# Altium schematic sheet STM32.SchDoc
size A; SheetNumber: 3; SheetTotal: 8
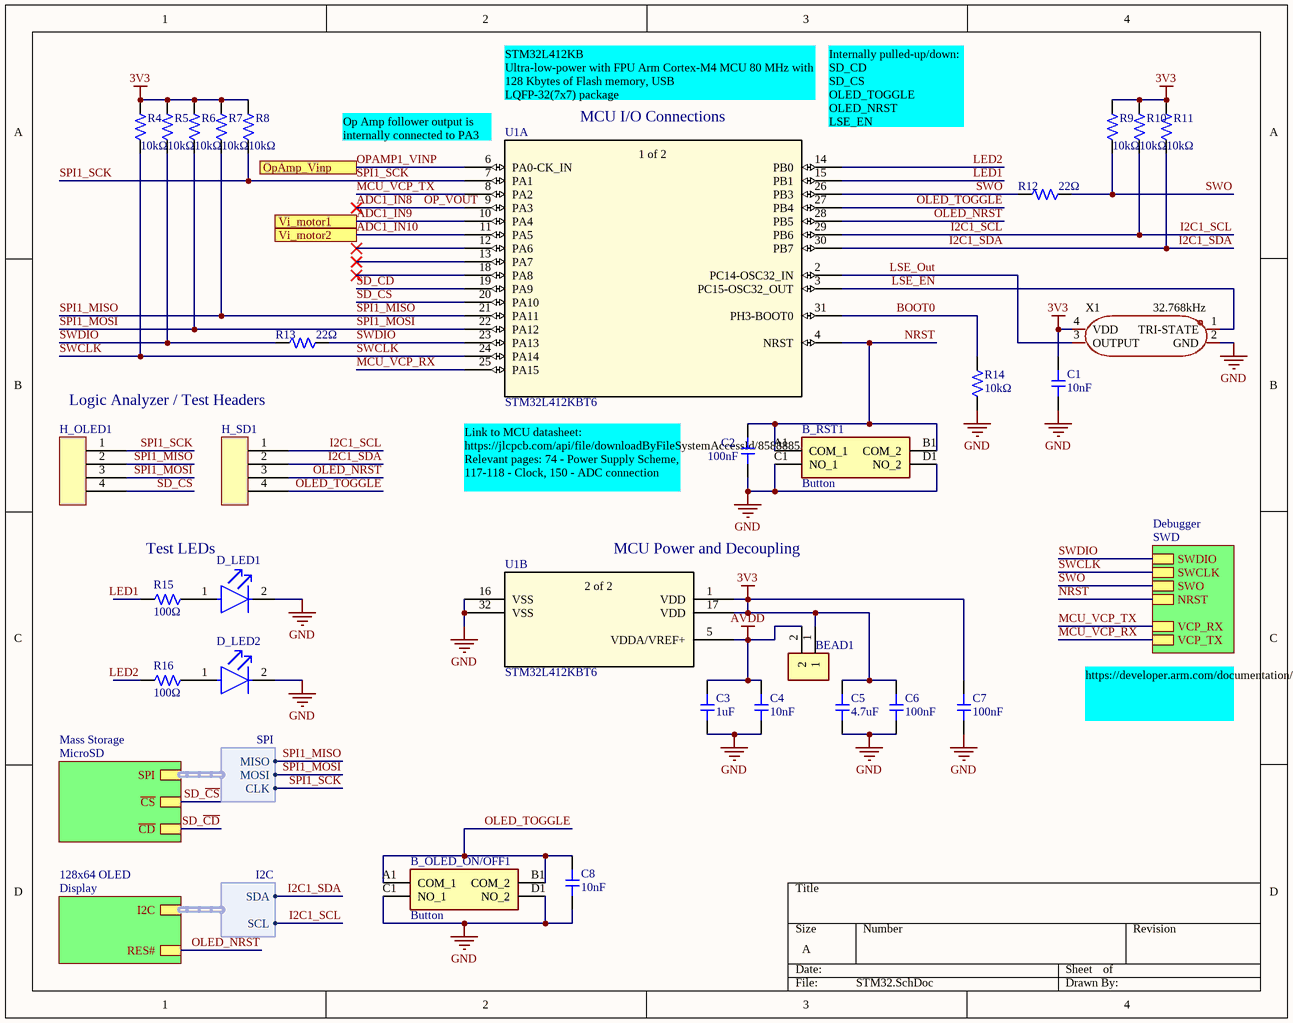
[diagram p0: STM32.SchDoc]

## Parts
B_OLED_ON/OFF1  Button  [TS1187ABAB]
B_RST1  Button  [TS1187ABAB]
BEAD1  GZ1608D601TF  [BEADC1608X95N]  (value not drawn)
C1  Capacitance: 10nF  [CAP-0402]  (hidden comment: CL05B103KB5NNNC)
C2  Capacitance: 100nF  [CAP-0402]  (hidden comment: CL05B104KB54PNC)
C3  Capacitance: 1uF  [CAP-0402]  (hidden comment: CL05A105KA5NQNC)
C4  Capacitance: 10nF  [CAP-0402]  (hidden comment: CL05B103KB5NNNC)
C5  Capacitance: 4.7uF  [CAP-0402]  (hidden comment: CL05A475MP5NRNC)
C6  Capacitance: 100nF  [CAP-0402]  (hidden comment: CL05B104KO5NNNC)
C7  Capacitance: 100nF  [CAP-0402]  (hidden comment: CL05B104KO5NNNC)
C8  Capacitance: 10nF  [CAP-0402]  (hidden comment: CL05B103KB5NNNC)
D_LED1  (no value)  [FP-AP2012EC-MFG]
D_LED2  (no value)  [FP-AP2012EC-MFG]
H_OLED1  4-pin Header  [4-pin Header]  (value not drawn)
H_SD1  4-pin Header  [4-pin Header]  (value not drawn)
R4  Resistance: 10kΩ  [RES-0402]  (hidden comment: 0402WGF1002TCE)
R5  Resistance: 10kΩ  [RES-0402]  (hidden comment: 0402WGF1002TCE)
R6  Resistance: 10kΩ  [RES-0402]  (hidden comment: 0402WGF1002TCE)
R7  Resistance: 10kΩ  [RES-0402]  (hidden comment: 0402WGF1002TCE)
R8  Resistance: 10kΩ  [RES-0402]  (hidden comment: 0402WGF1002TCE)
R9  Resistance: 10kΩ  [RES-0402]  (hidden comment: 0402WGF1002TCE)
R10  Resistance: 10kΩ  [RES-0402]  (hidden comment: 0402WGF1002TCE)
R11  Resistance: 10kΩ  [RES-0402]  (hidden comment: 0402WGF1002TCE)
R12  Resistance: 22Ω  [RES-0402]  (hidden comment: 0402WGF220JTCE)
R13  Resistance: 22Ω  [RES-0402]  (hidden comment: 0402WGF220JTCE)
R14  Resistance: 10kΩ  [RES-0402]  (hidden comment: 0402WGF1002TCE)
R15  Resistance: 100Ω  [RES-0402]  (hidden comment: 0402WGF1000TCE)
R16  Resistance: 100Ω  [RES-0402]  (hidden comment: 0402WGF1000TCE)
U1  STM32L412KBT6  [LQFP-32]  (parts A,B of 2)
X1  32.768kHz  [OSC-SMD_4P-L3.2-W2.5-BL]

## Sub-sheets
128x64 OLED = Display: I2C (harness I2C), RES#
Debugger = SWD: SWDIO, SWCLK, SWO, NRST, VCP_TX, VCP_RX
Mass Storage = MicroSD: SPI (harness SPI), ~{CS}, ~{CD}

## Ports
OpAmp_Vinp (see Power[3B]), Vi_motor1 (see Power[3B]), Vi_motor2 (see Power[3B])

## Harnesses
SPI: MISO, MOSI, CLK
I2C: SDA, SCL

## Nets
3V3: BEAD1.1 C1.2 C5.2 C6.2 C7.2 R4.2 R5.2 R6.2 R7.2 R8.2 R9.2 R10.2 R11.2 U1.1(VDD) U1.17(VDD) X1.4(VDD)
AVDD: BEAD1.2 C3.2 C4.2 U1.5(VDDA/VREF+)
GND: B_OLED_ON/OFF1.C1(NO_1) B_OLED_ON/OFF1.D1(NO_2) B_RST1.C1(NO_1) B_RST1.D1(NO_2) C1.1 C2.1 C3.1 C4.1 C5.1 C6.1 C7.1 C8.1 D_LED1.2(C) D_LED2.2(C) R14.1 U1.16(VSS) U1.32(VSS) X1.2(GND)
ADC1_IN8: U1.9(PA3)  [also labelled OP_VOUT]
ADC1_IN9: U1.10(PA4) ; port Vi_motor1
ADC1_IN10: U1.11(PA5) ; port Vi_motor2
BOOT0: R14.2 U1.31(PH3-BOOT0)
I2C1_SCL: H_SD1.1 R10.1 U1.29(PB6) ; sheet 128x64 OLED/I2C.SCL
I2C1_SDA: H_SD1.2 R11.1 U1.30(PB7) ; sheet 128x64 OLED/I2C.SDA
LED1: R15.1 U1.15(PB1)
LED2: R16.1 U1.14(PB0)
LSE_EN: U1.3(PC15-OSC32_OUT) X1.1(TRI-STATE)
LSE_Out: U1.2(PC14-OSC32_IN) X1.3(OUTPUT)
MCU_VCP_RX: U1.25(PA15) ; sheet Debugger/VCP_TX
MCU_VCP_TX: U1.8(PA2) ; sheet Debugger/VCP_RX
NRST: B_RST1.A1(COM_1) B_RST1.B1(COM_2) C2.2 U1.4(NRST) ; sheet Debugger/NRST
OLED_NRST: H_SD1.3 U1.28(PB5) ; sheet 128x64 OLED/RES#
OLED_TOGGLE: B_OLED_ON/OFF1.A1(COM_1) B_OLED_ON/OFF1.B1(COM_2) C8.2 H_SD1.4 U1.27(PB4)
OPAMP1_VINP: U1.6(PA0-CK_IN) ; port OpAmp_Vinp
SD_~{CD}: U1.19(PA9) ; sheet Mass Storage/~{CD}
SD_~{CS}: H_OLED1.4 U1.20(PA10) ; sheet Mass Storage/~{CS}
SPI1_MISO: H_OLED1.2 R7.1 U1.21(PA11) ; sheet Mass Storage/SPI.MISO
SPI1_MOSI: H_OLED1.3 R6.1 U1.22(PA12) ; sheet Mass Storage/SPI.MOSI
SPI1_SCK: H_OLED1.1 R8.1 U1.7(PA1) ; sheet Mass Storage/SPI.CLK
SWCLK: R4.1 U1.24(PA14) ; sheet Debugger/SWCLK
SWDIO: R5.1 R13.1 R13.2 U1.23(PA13) ; sheet Debugger/SWDIO
SWO: R9.1 R12.1 R12.2 U1.26(PB3) ; sheet Debugger/SWO
NetD_LED1_1: D_LED1.1(A) R15.2
NetD_LED2_1: D_LED2.1(A) R16.2

Not connected (* = marked no-connect by the designer): U1 12(PA6)* 13(PA7)* 18(PA8)*

## Notes on the sheet
- STM32L412KB
  Ultra-low-power with FPU Arm Cortex-M4 MCU 80 MHz with 128 Kbytes of Flash memory, USB
  LQFP-32(7x7) package
- (near U1) Op Amp follower output is internally connected to PA3
- (near U1) MCU I/O Connections
- (near U1) Internally pulled-up/down:
  SD_CD
  SD_CS
  OLED_TOGGLE
  OLED_NRST
  LSE_EN
- Logic Analyzer / Test Headers
- Link to MCU datasheet: https://jlcpcb.com/api/file/downloadByFileSystemAccessId/8588885545674424320
  Relevant pages: 74 - Power Supply Scheme, 117-118 - Clock, 150 - ADC connection
- Test LEDs
- (near U1) MCU Power and Decoupling
- https://developer.arm.com/documentation/dui0499/a/Target-Interface-Connections/SWD-connections
- (in symbol STM32L412KBT6, part A) 1 of 2
- (in symbol STM32L412KBT6, part B) 2 of 2

## Library data of the parts
B_OLED_ON/OFF1 B_RST1 = TS-1187A-B-A-B: Manufacturer_Name: XKB Connectivity; Datasheet Link: http://www.helloxkb.com/public/images/pdf/TS-1187A-X-X-X.pdf; Height: 4.05mm; Manufacturer_Part_Number: TS-1187A-B-A-B
BEAD1 = GZ1608D601TF: Ferrite Bead; Manufacturer_Name: SUNLORD; Datasheet Link: https://datasheet.lcsc.com/szlcsc/Sunlord-GZ1608D601TF_C1002.pdf; Height: 0.95mm; Manufacturer_Part_Number: GZ1608D601TF
C1 C4 C8 = CL05B103KB5NNNC: Capacitor, Ceramic (MLCC), 10nF, ±10%, 50V, X7R, ±10%, SMD 0402; Manufacturer: Samsung Electro-Mechanics; Temperature Rating: -55°C ~ 125°C; Capacitance @ 1V DC Bias: 10.426nF; Capacitance @ 1.2V DC Bias: 10.434nF; Capacitance @ 1.35V DC Bias: 10.444nF; Capacitance @ 1.5V DC Bias: 10.455nF; Capacitance @ 1.8V DC Bias: 10.480nF; Capacitance @ 2.5V DC Bias: 10.514nF; Capacitance @ 3.3V DC Bias: 10.519nF; Capacitance @ 3.7V DC Bias: 10.504nF; Capacitance @ 4.2V DC Bias: 10.473nF; Capacitance @ 5V DC Bias: 10.402nF; Capacitance @ 9V DC Bias: 10.052nF; Capacitance @ 12V DC Bias: 9.639nF; Capacitance @ 15V DC Bias: 9.187nF; Capacitance @ 24V DC Bias: 7.606nF; Capacitance @ 36V DC Bias: 5.499nF; Capacitance @ 48V DC Bias: 3.591nF; Impedance (0V Bias) @ 100Hz: 1.57E+05Ω; Impedance (0V Bias) @ 500Hz: 3.19E+04Ω; Impedance (0V Bias) @ 1kHz: 1.61E+04Ω; Impedance (0V Bias) @ 5kHz: 3.27E+03Ω; Impedance (0V Bias) @ 10kHz: 1.65E+03Ω; Impedance (0V Bias) @ 50kHz: 335Ω; Impedance (0V Bias) @ 100kHz: 169Ω; Impedance (0V Bias) @ 500kHz: 34.3Ω; Impedance (0V Bias) @ 1MHz: 17.3Ω; Impedance (0V Bias) @ 5MHz: 3.52Ω; Impedance (0V Bias) @ 10MHz: 1.77Ω; Impedance (0V Bias) @ 50MHz: 0.285Ω; Impedance (0V Bias) @ 100MHz: 0.0835Ω; Impedance (0V Bias) @ 500MHz: 0.751Ω; Impedance (0V Bias) @ 1GHz: 1.42Ω; Impedance (0V Bias) @ 2GHz: 3.22Ω; Impedance (0V Bias) @ 5GHz: 6.48Ω; Package Size: 0402; JLCPCB Basic Part: Yes; JLCPCB Part Number: C15195; Supplier 1: LCSC; Category: Capacitors - MLCC; Supplier Part Number 1: C15195; Manufacturer Part Number: CL05B103KB5NNNC; Tolerance: ±10%; Voltage Rating: 50V; Temperature Coefficient: X7R; RoHS: Yes; ComponentLink1Description: Datasheet; ComponentLink1URL: https://wmsc.lcsc.com/wmsc/upload/file/pdf/v2/lcsc/2304140030_Samsung-Electro-Mechanics-CL05B103KB5NNNC_C15195.pdf; ComponentLink2Description: JLCPCB Part URL; ComponentLink2URL: https://jlcpcb.com/partdetail/C15195; ComponentLink3Description: LCSC Part URL; ComponentLink3URL: https://lcsc.com/product-detail/Multilayer-Ceramic-Capacitors-MLCC---SMD-SMT_Samsung-Electro-Mechanics-Samsung-Electro-Mechanics-CL05B103KB5NNNC_C15195.html; ComponentLink4Description: Samsung Component Library; ComponentLink4URL: https://weblib.samsungsem.com/mlcc/mlcc-ec.do?partNumber=CL05B103KB5NNN
C2 = CL05B104KB54PNC: Capacitor, Ceramic (MLCC), 100nF, ±10%, 50V, X7R, ±10%, SMD 0402; Manufacturer: Samsung Electro-Mechanics; Temperature Rating: -55°C ~ 125°C; Capacitance @ 1V DC Bias: 105.687nF; Capacitance @ 1.2V DC Bias: 105.639nF; Capacitance @ 1.35V DC Bias: 105.594nF; Capacitance @ 1.5V DC Bias: 105.528nF; Capacitance @ 1.8V DC Bias: 105.317nF; Capacitance @ 2.5V DC Bias: 104.216nF; Capacitance @ 3.3V DC Bias: 102.385nF; Capacitance @ 3.7V DC Bias: 101.236nF; Capacitance @ 4.2V DC Bias: 99.650nF; Capacitance @ 5V DC Bias: 96.918nF; Capacitance @ 9V DC Bias: 81.073nF; Capacitance @ 12V DC Bias: 69.786nF; Capacitance @ 15V DC Bias: 59.475nF; Capacitance @ 24V DC Bias: 38.112nF; Capacitance @ 36V DC Bias: 23.027nF; Capacitance @ 48V DC Bias: 16.035nF; Impedance (0V Bias) @ 100Hz: 1.66E+04Ω; Impedance (0V Bias) @ 500Hz: 3.38E+03Ω; Impedance (0V Bias) @ 1kHz: 1.7E+03Ω; Impedance (0V Bias) @ 5kHz: 346Ω; Impedance (0V Bias) @ 10kHz: 175Ω; Impedance (0V Bias) @ 50kHz: 35.5Ω; Impedance (0V Bias) @ 100kHz: 17.9Ω; Impedance (0V Bias) @ 500kHz: 3.64Ω; Impedance (0V Bias) @ 1MHz: 1.84Ω; Impedance (0V Bias) @ 5MHz: 0.366Ω; Impedance (0V Bias) @ 10MHz: 0.172Ω; Impedance (0V Bias) @ 50MHz: 0.0626Ω; Impedance (0V Bias) @ 100MHz: 0.128Ω; Impedance (0V Bias) @ 500MHz: 0.487Ω; Impedance (0V Bias) @ 1GHz: 0.87Ω; Impedance (0V Bias) @ 2GHz: 2Ω; Impedance (0V Bias) @ 5GHz: 3.96Ω; Package Size: 0402; JLCPCB Basic Part: Yes; JLCPCB Part Number: C307331; Supplier 1: LCSC; Category: Capacitors - MLCC; Supplier Part Number 1: C307331; Manufacturer Part Number: CL05B104KB54PNC; Tolerance: ±10%; Voltage Rating: 50V; Temperature Coefficient: X7R; RoHS: Yes; ComponentLink1Description: Datasheet; ComponentLink1URL: https://wmsc.lcsc.com/wmsc/upload/file/pdf/v2/lcsc/2304140030_Samsung-Electro-Mechanics-CL05B104KB54PNC_C307331.pdf; ComponentLink2Description: JLCPCB Part URL; ComponentLink2URL: https://jlcpcb.com/partdetail/C307331; ComponentLink3Description: LCSC Part URL; ComponentLink3URL: https://lcsc.com/product-detail/Multilayer-Ceramic-Capacitors-MLCC---SMD-SMT_Samsung-Electro-Mechanics-Samsung-Electro-Mechanics-CL05B104KB54PNC_C307331.html; ComponentLink4Description: Samsung Component Library; ComponentLink4URL: https://weblib.samsungsem.com/mlcc/mlcc-ec.do?partNumber=CL05B104KB54PN
C3 = CL05A105KA5NQNC: Capacitor, Ceramic (MLCC), 1uF, ±10%, 25V, X5R, ±10%, SMD 0402; Manufacturer: Samsung Electro-Mechanics; Temperature Rating: -55°C ~ 85°C; Capacitance @ 1V DC Bias: 1.014uF; Capacitance @ 1.2V DC Bias: 0.983uF; Capacitance @ 1.35V DC Bias: 0.958uF; Capacitance @ 1.5V DC Bias: 0.932uF; Capacitance @ 1.8V DC Bias: 0.879uF; Capacitance @ 2.5V DC Bias: 0.755uF; Capacitance @ 3.3V DC Bias: 0.618uF; Capacitance @ 3.7V DC Bias: 0.562uF; Capacitance @ 4.2V DC Bias: 0.501uF; Capacitance @ 5V DC Bias: 0.420uF; Capacitance @ 9V DC Bias: 0.204uF; Capacitance @ 12V DC Bias: 0.147uF; Capacitance @ 15V DC Bias: 0.107uF; Capacitance @ 24V DC Bias: 0.061uF; Impedance (0V Bias) @ 100Hz: 1.95E+03Ω; Impedance (0V Bias) @ 500Hz: 402Ω; Impedance (0V Bias) @ 1kHz: 204Ω; Impedance (0V Bias) @ 5kHz: 42Ω; Impedance (0V Bias) @ 10kHz: 21.3Ω; Impedance (0V Bias) @ 50kHz: 4.4Ω; Impedance (0V Bias) @ 100kHz: 2.23Ω; Impedance (0V Bias) @ 500kHz: 0.462Ω; Impedance (0V Bias) @ 1MHz: 0.234Ω; Impedance (0V Bias) @ 5MHz: 0.0392Ω; Impedance (0V Bias) @ 10MHz: 0.0118Ω; Impedance (0V Bias) @ 50MHz: 0.0671Ω; Impedance (0V Bias) @ 100MHz: 0.118Ω; Impedance (0V Bias) @ 500MHz: 0.452Ω; Impedance (0V Bias) @ 1GHz: 0.812Ω; Impedance (0V Bias) @ 2GHz: 1.8Ω; Impedance (0V Bias) @ 5GHz: 3.57Ω; Impedance (25V Bias) @ 100Hz: 2.62E+04Ω; Impedance (25V Bias) @ 500Hz: 5.28E+03Ω; Impedance (25V Bias) @ 1kHz: 2.65E+03Ω; Impedance (25V Bias) @ 5kHz: 533Ω; Impedance (25V Bias) @ 10kHz: 267Ω; Impedance (25V Bias) @ 50kHz: 53.8Ω; Impedance (25V Bias) @ 100kHz: 27Ω; Impedance (25V Bias) @ 500kHz: 5.42Ω; Impedance (25V Bias) @ 1MHz: 2.7Ω; Impedance (25V Bias) @ 5MHz: 0.621Ω; Impedance (25V Bias) @ 10MHz: 0.298Ω; Impedance (25V Bias) @ 50MHz: 0.0523Ω; Impedance (25V Bias) @ 100MHz: 0.113Ω; Impedance (25V Bias) @ 500MHz: 0.451Ω; Impedance (25V Bias) @ 1GHz: 0.82Ω; Impedance (25V Bias) @ 2GHz: 1.85Ω; Impedance (25V Bias) @ 5GHz: 3.51Ω; Package Size: 0402; JLCPCB Basic Part: Yes; JLCPCB Part Number: C52923; Supplier 1: LCSC; Category: Capacitors - MLCC; Supplier Part Number 1: C52923; Manufacturer Part Number: CL05A105KA5NQNC; Tolerance: ±10%; Voltage Rating: 25V; Temperature Coefficient: X5R; RoHS: Yes; ComponentLink1Description: Datasheet; ComponentLink1URL: https://wmsc.lcsc.com/wmsc/upload/file/pdf/v2/lcsc/2304140030_Samsung-Electro-Mechanics-CL05A105KA5NQNC_C52923.pdf; ComponentLink2Description: JLCPCB Part URL; ComponentLink2URL: https://jlcpcb.com/partdetail/C52923; ComponentLink3Description: LCSC Part URL; ComponentLink3URL: https://lcsc.com/product-detail/Multilayer-Ceramic-Capacitors-MLCC---SMD-SMT_Samsung-Electro-Mechanics-Samsung-Electro-Mechanics-CL05A105KA5NQNC_C52923.html; ComponentLink4Description: Samsung Component Library; ComponentLink4URL: https://weblib.samsungsem.com/mlcc/mlcc-ec.do?partNumber=CL05A105KA5NQN
C5 = CL05A475MP5NRNC: Capacitor, Ceramic (MLCC), 4.7uF, ±20%, 10V, X5R, ±20%, SMD 0402; Manufacturer: Samsung Electro-Mechanics; Temperature Rating: -55°C ~ 85°C; Capacitance @ 1V DC Bias: 4.048uF; Capacitance @ 1.2V DC Bias: 3.816uF; Capacitance @ 1.35V DC Bias: 3.633uF; Capacitance @ 1.5V DC Bias: 3.450uF; Capacitance @ 1.8V DC Bias: 3.100uF; Capacitance @ 2.5V DC Bias: 2.453uF; Capacitance @ 3.3V DC Bias: 1.872uF; Capacitance @ 3.7V DC Bias: 1.663uF; Capacitance @ 4.2V DC Bias: 1.455uF; Capacitance @ 5V DC Bias: 1.191uF; Capacitance @ 9V DC Bias: 0.548uF; Impedance (0V Bias) @ 100Hz: 442Ω; Impedance (0V Bias) @ 500Hz: 90.2Ω; Impedance (0V Bias) @ 1kHz: 45.6Ω; Impedance (0V Bias) @ 5kHz: 9.34Ω; Impedance (0V Bias) @ 10kHz: 4.72Ω; Impedance (0V Bias) @ 50kHz: 0.964Ω; Impedance (0V Bias) @ 100kHz: 0.486Ω; Impedance (0V Bias) @ 500kHz: 0.0987Ω; Impedance (0V Bias) @ 1MHz: 0.0479Ω; Impedance (0V Bias) @ 5MHz: 0.00709Ω; Impedance (0V Bias) @ 10MHz: 0.0183Ω; Impedance (0V Bias) @ 50MHz: 0.06Ω; Impedance (0V Bias) @ 100MHz: 0.102Ω; Impedance (0V Bias) @ 500MHz: 0.377Ω; Impedance (0V Bias) @ 1GHz: 0.66Ω; Impedance (0V Bias) @ 2GHz: 1.52Ω; Impedance (0V Bias) @ 5GHz: 3.05Ω; Impedance (10V Bias) @ 100Hz: 3.34E+03Ω; Impedance (10V Bias) @ 500Hz: 674Ω; Impedance (10V Bias) @ 1kHz: 338Ω; Impedance (10V Bias) @ 5kHz: 68.2Ω; Impedance (10V Bias) @ 10kHz: 34.2Ω; Impedance (10V Bias) @ 50kHz: 6.88Ω; Impedance (10V Bias) @ 100kHz: 3.45Ω; Impedance (10V Bias) @ 500kHz: 0.693Ω; Impedance (10V Bias) @ 1MHz: 0.344Ω; Impedance (10V Bias) @ 5MHz: 0.0603Ω; Impedance (10V Bias) @ 10MHz: 0.0164Ω; Impedance (10V Bias) @ 50MHz: 0.064Ω; Impedance (10V Bias) @ 100MHz: 0.105Ω; Impedance (10V Bias) @ 500MHz: 0.385Ω; Impedance (10V Bias) @ 1GHz: 0.673Ω; Impedance (10V Bias) @ 5GHz: 3.06Ω; Package Size: 0402; JLCPCB Basic Part: Yes; JLCPCB Part Number: C23733; Supplier 1: LCSC; Category: Capacitors - MLCC; Supplier Part Number 1: C23733; Manufacturer Part Number: CL05A475MP5NRNC; Tolerance: ±20%; Voltage Rating: 10V; Temperature Coefficient: X5R; RoHS: Yes; ComponentLink1Description: Datasheet; ComponentLink1URL: https://wmsc.lcsc.com/wmsc/upload/file/pdf/v2/lcsc/2304140030_Samsung-Electro-Mechanics-CL05A475MP5NRNC_C23733.pdf; ComponentLink2Description: JLCPCB Part URL; ComponentLink2URL: https://jlcpcb.com/partdetail/C23733; ComponentLink3Description: LCSC Part URL; ComponentLink3URL: https://lcsc.com/product-detail/Multilayer-Ceramic-Capacitors-MLCC---SMD-SMT_Samsung-Electro-Mechanics-Samsung-Electro-Mechanics-CL05A475MP5NRNC_C23733.html; ComponentLink4Description: Samsung Component Library; ComponentLink4URL: https://weblib.samsungsem.com/mlcc/mlcc-ec.do?partNumber=CL05A475MP5NRN; Impedance (10V Bias) @ 2GHz: 1.52Ω
C6 C7 = CL05B104KO5NNNC: Capacitor, Ceramic (MLCC), 100nF, ±10%, 16V, X7R, ±10%, SMD 0402; Manufacturer: Samsung Electro-Mechanics; Temperature Rating: -55°C ~ 125°C; Capacitance @ 1V DC Bias: 104.721nF; Capacitance @ 1.2V DC Bias: 104.598nF; Capacitance @ 1.35V DC Bias: 104.495nF; Capacitance @ 1.5V DC Bias: 104.372nF; Capacitance @ 1.8V DC Bias: 104.042nF; Capacitance @ 2.5V DC Bias: 102.634nF; Capacitance @ 3.3V DC Bias: 100.452nF; Capacitance @ 3.7V DC Bias: 99.160nF; Capacitance @ 4.2V DC Bias: 97.441nF; Capacitance @ 5V DC Bias: 94.577nF; Capacitance @ 9V DC Bias: 78.638nF; Capacitance @ 12V DC Bias: 66.291nF; Capacitance @ 15V DC Bias: 54.779nF; Impedance (0V Bias) @ 100Hz: 1.71E+04Ω; Impedance (0V Bias) @ 500Hz: 3.48E+03Ω; Impedance (0V Bias) @ 1kHz: 1.75E+03Ω; Impedance (0V Bias) @ 5kHz: 356Ω; Impedance (0V Bias) @ 10kHz: 179Ω; Impedance (0V Bias) @ 50kHz: 36.4Ω; Impedance (0V Bias) @ 100kHz: 18.3Ω; Impedance (0V Bias) @ 500kHz: 3.72Ω; Impedance (0V Bias) @ 1MHz: 1.87Ω; Impedance (0V Bias) @ 5MHz: 0.373Ω; Impedance (0V Bias) @ 10MHz: 0.175Ω; Impedance (0V Bias) @ 50MHz: 0.064Ω; Impedance (0V Bias) @ 100MHz: 0.122Ω; Impedance (0V Bias) @ 500MHz: 0.525Ω; Impedance (0V Bias) @ 1GHz: 0.97Ω; Impedance (0V Bias) @ 2GHz: 2.26Ω; Impedance (0V Bias) @ 5GHz: 4.75Ω; Impedance (16V Bias) @ 100Hz: 2.55E+04Ω; Impedance (16V Bias) @ 500Hz: 5.18E+03Ω; Impedance (16V Bias) @ 1kHz: 2.61E+03Ω; Impedance (16V Bias) @ 5kHz: 529Ω; Impedance (16V Bias) @ 10kHz: 266Ω; Impedance (16V Bias) @ 50kHz: 54Ω; Impedance (16V Bias) @ 100kHz: 27.2Ω; Impedance (16V Bias) @ 500kHz: 5.5Ω; Impedance (16V Bias) @ 1MHz: 2.76Ω; Impedance (16V Bias) @ 5MHz: 0.587Ω; Impedance (16V Bias) @ 10MHz: 0.277Ω; Impedance (16V Bias) @ 50MHz: 0.0412Ω; Impedance (16V Bias) @ 100MHz: 0.133Ω; Impedance (16V Bias) @ 500MHz: 0.524Ω; Impedance (16V Bias) @ 1GHz: 0.969Ω; Impedance (16V Bias) @ 2GHz: 2.25Ω; Impedance (16V Bias) @ 5GHz: 4.7Ω; Package Size: 0402; JLCPCB Basic Part: Yes; JLCPCB Part Number: C1525; Supplier 1: LCSC; Category: Capacitors - MLCC; Supplier Part Number 1: C1525; Manufacturer Part Number: CL05B104KO5NNNC; Tolerance: ±10%; Voltage Rating: 16V; Temperature Coefficient: X7R; RoHS: Yes; ComponentLink1Description: Datasheet; ComponentLink1URL: https://wmsc.lcsc.com/wmsc/upload/file/pdf/v2/lcsc/2304140030_Samsung-Electro-Mechanics-CL05B104KO5NNNC_C1525.pdf; ComponentLink2Description: JLCPCB Part URL; ComponentLink2URL: https://jlcpcb.com/partdetail/C1525; ComponentLink3Description: LCSC Part URL; ComponentLink3URL: https://lcsc.com/product-detail/Multilayer-Ceramic-Capacitors-MLCC---SMD-SMT_Samsung-Electro-Mechanics-Samsung-Electro-Mechanics-CL05B104KO5NNNC_C1525.html; ComponentLink4Description: Samsung Component Library; ComponentLink4URL: https://weblib.samsungsem.com/mlcc/mlcc-ec.do?partNumber=CL05B104KO5NNN
D_LED1 D_LED2 = CMP-44529-000070-1: LED RED CLEAR SMD; Forward Voltage: 2V; Test Current: 20mA; Luminous Intensity: 15mcd; Viewing Angle: 120°; Wavelength: 627nm; Dominant Wavelength: 625nm; Lead Free: Lead Free; Length: 2mm; Forward Current: 20mA; Mount: Surface Mount; Packaging: Tape and Reel; Illumination Color: Red; Color: Red; Height: 1.1mm; Case Code (Metric): 2012; Case Code (Imperial): 0805; Case/Package: 0805; Width: 1.25mm; RoHS Compliant: Yes; Package Quantity: 2000; Min Operating Temperature: -40°C; Max Operating Temperature: 85°C; Lens Style: Clear
H_OLED1 H_SD1 = 4-pin Header: 4-pin Header 0.1mm pitch
R4-R11 R14 = 0402WGF1002TCE: Resistor, 10kΩ, ±1%, 62.5mW, 50V, ±100ppm/℃, -55℃~+155℃, SMD 0402; Manufacturer: Uniroyal; Supplier 1: LCSC; Manufacturer Part Number: 0402WGF1002TCE; Supplier Part Number 1: C25744; JLCPCB Part Number: C25744; Power Rating: 62.5mW; Category: Resistors; Package Size: 0402; JLCPCB Basic Part: Yes; Tolerance: ±1%; Voltage Rating: 50V; Temperature Coefficient: ±100ppm/℃; Temperature Rating: -55℃~+155℃; ComponentLink1Description: Datasheet; ComponentLink1URL: https://wmsc.lcsc.com/wmsc/upload/file/pdf/v2/lcsc/2206010100_UNI-ROYAL-Uniroyal-Elec-0402WGF1002TCE_C25744.pdf; ComponentLink2Description: JLCPCB Part URL; ComponentLink2URL: https://jlcpcb.com/partdetail/C25744
R12 R13 = 0402WGF220JTCE: Resistor, 22Ω, ±1%, 62.5mW, 50V, ±200ppm/℃, -55℃~+155℃, SMD 0402; Manufacturer: Uniroyal; Supplier 1: LCSC; Manufacturer Part Number: 0402WGF220JTCE; Supplier Part Number 1: C25092; JLCPCB Part Number: C25092; Power Rating: 62.5mW; Category: Resistors; Package Size: 0402; JLCPCB Basic Part: Yes; Tolerance: ±1%; Voltage Rating: 50V; Temperature Coefficient: ±200ppm/℃; Temperature Rating: -55℃~+155℃; ComponentLink1Description: Datasheet; ComponentLink1URL: https://wmsc.lcsc.com/wmsc/upload/file/pdf/v2/lcsc/2205311900_UNI-ROYAL-Uniroyal-Elec-0402WGF220JTCE_C25092.pdf; ComponentLink2Description: JLCPCB Part URL; ComponentLink2URL: https://jlcpcb.com/partdetail/C25092
R15 R16 = 0402WGF1000TCE: Resistor, 100Ω, ±1%, 62.5mW, 50V, ±200ppm/℃, -55℃~+155℃, SMD 0402; Manufacturer: Uniroyal; Supplier 1: LCSC; Manufacturer Part Number: 0402WGF1000TCE; Supplier Part Number 1: C25076; JLCPCB Part Number: C25076; Power Rating: 62.5mW; Category: Resistors; Package Size: 0402; JLCPCB Basic Part: Yes; Tolerance: ±1%; Voltage Rating: 50V; Temperature Coefficient: ±200ppm/℃; Temperature Rating: -55℃~+155℃; ComponentLink1Description: Datasheet; ComponentLink1URL: https://wmsc.lcsc.com/wmsc/upload/file/pdf/v2/lcsc/2205311900_UNI-ROYAL-Uniroyal-Elec-0402WGF1000TCE_C25076.pdf; ComponentLink2Description: JLCPCB Part URL; ComponentLink2URL: https://jlcpcb.com/partdetail/C25076
U1 = STM32L412KBT6: No Description Available; Mfr_Name: STMicroelectronics; RefDes: RefDes; Type: Type
X1 = SX3M32.768KM20F30TNN: Manufacturer: SCTF(星通时频); Add into BOM: yes; Normal temperature Frequency Tolerance: ±20ppm; Output Type: CMOS; Voltage - Supply: 1.62V~3.63V; Current - Supply: 90uA; Frequency Stability: ±30ppm; Symbol: SX3M32.768KM20F30TNN; Device: SX3M32.768KM20F30TNN; LCSC Part Name: 32.768kHz ±20ppm 1.62V~3.63V CMOS; Supplier Part: C2901582; Manufacturer Part: SX3M32.768KM20F30TNN; Supplier Footprint: SMD3225-4P; JLCPCB Part Class: Extended Part; Datasheet: https://atta.szlcsc.com/upload/public/pdf/source/20240605/38A6F081BC26201D4BADAAB4D2EED01C.pdf; Supplier: LCSC; Convert to PCB: yes; Value: 32.768kHz; Operating Temperature: -40℃~+85℃